# EAGLE design FLC100_shield_v2.0 (EAGLE 6.4)
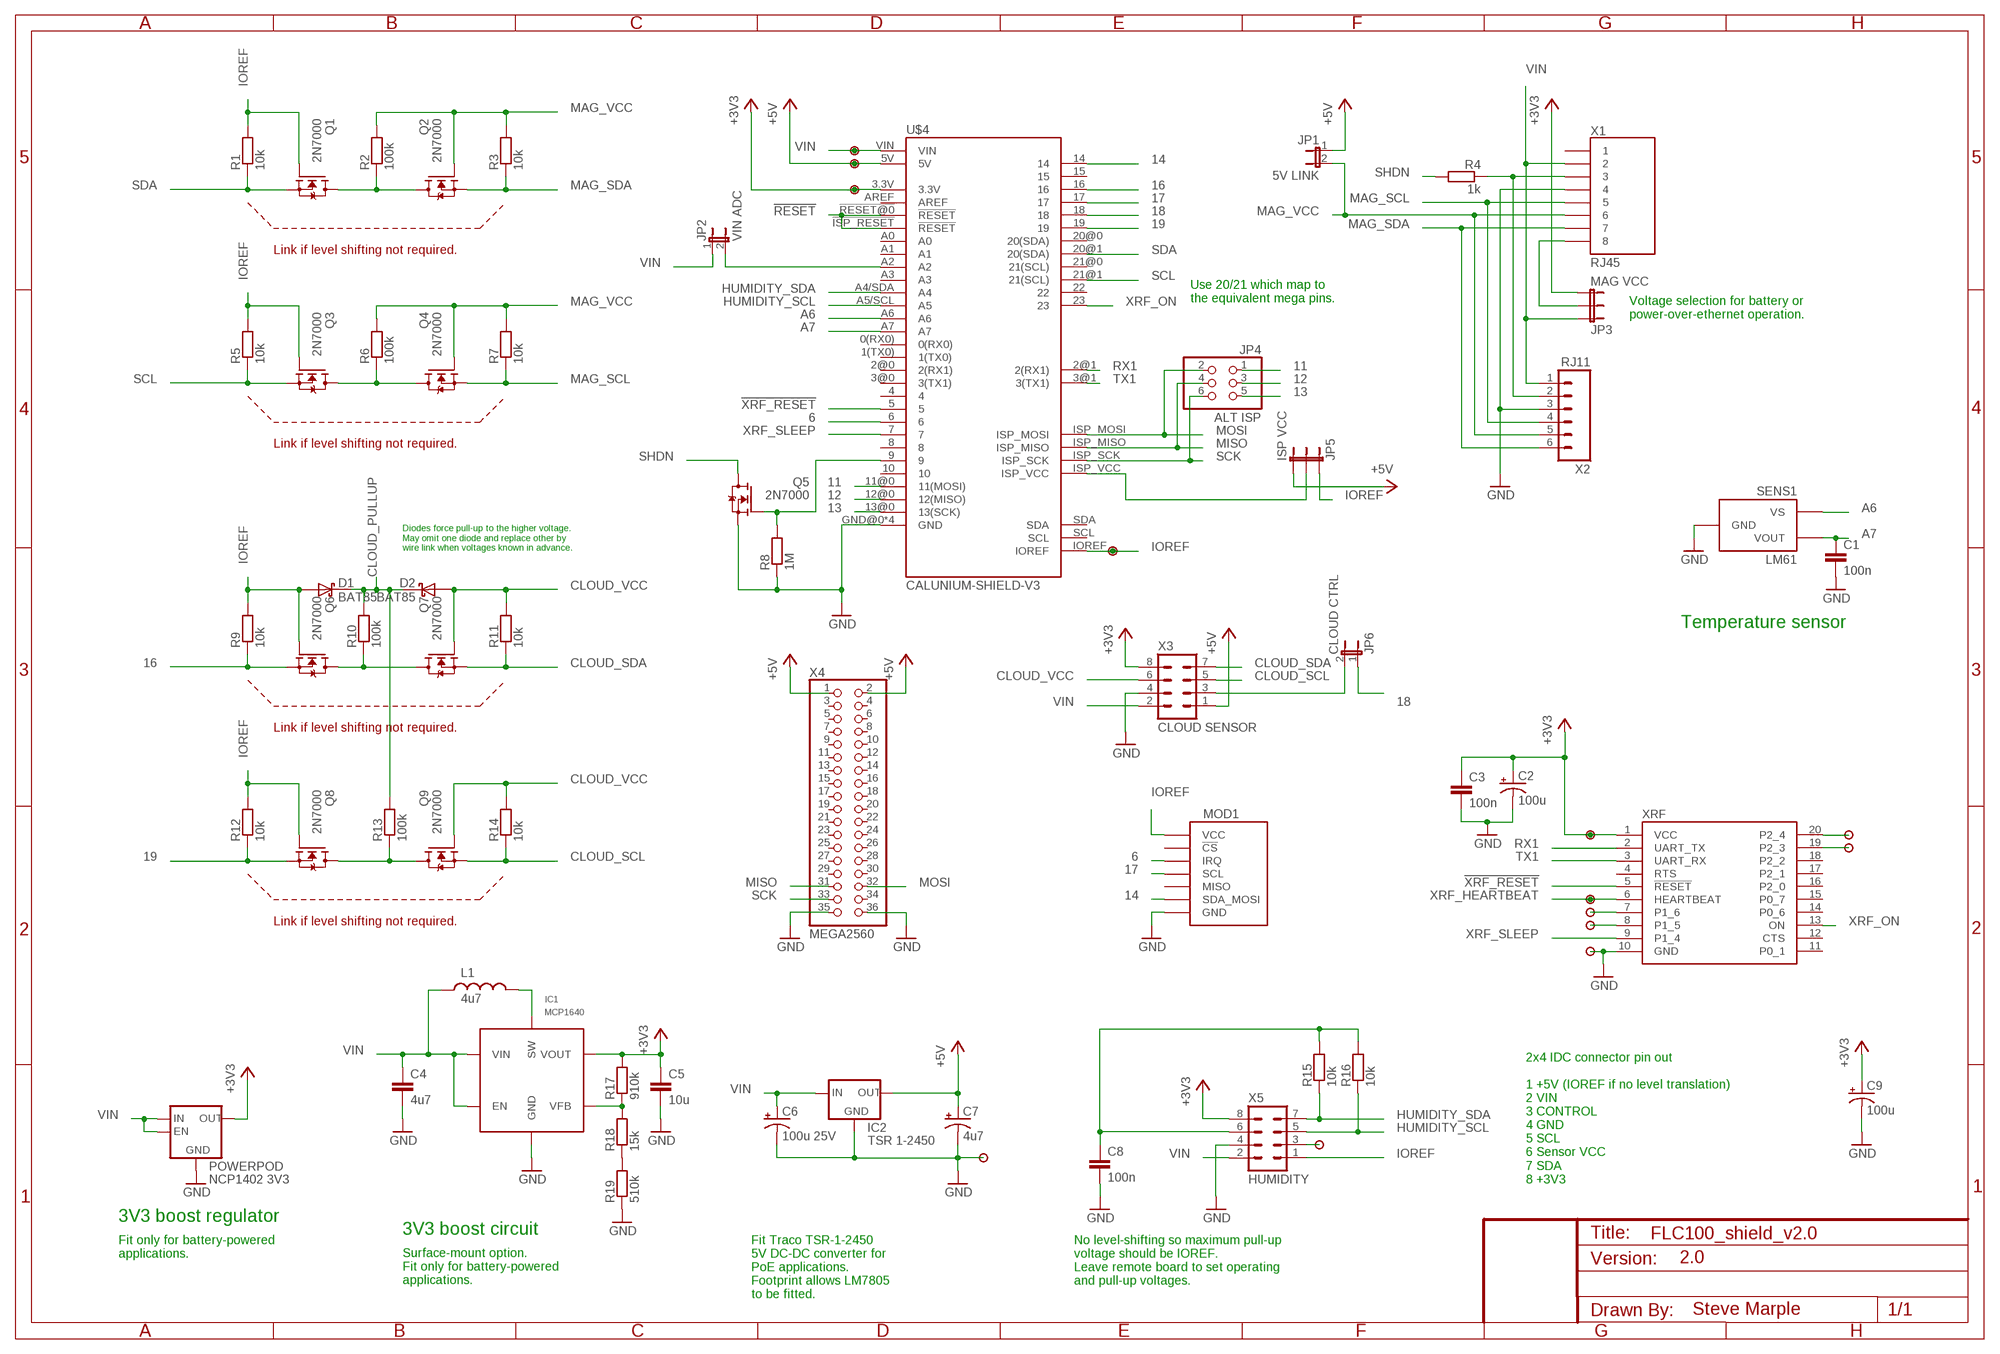
[diagram p0: schematic, sheet 1]

## Parts
C1  100n  CAPPTH  [CAP-PTH-SMALL]
C2  100u  CAP_POLPTH2  [CPOL-RADIAL-10UF-25V]
C3  100n  CAPPTH  [CAP-PTH-SMALL]
C4  4u7  C-EU1206-HAND  [1206-HAND]
C5  10u  C-EU1206-HAND  [1206-HAND]
C6  100u 25V  CAP_POL  [CPOL-RADIAL-100UF-25V-150MIL]
C7  4u7  CAP_POLPTH2  [CPOL-RADIAL-10UF-25V]
C8  100n  CAPPTH  [CAP-PTH-SMALL]
C9  100u  CAP_POLPTH2  [CPOL-RADIAL-10UF-25V]
D1  BAT85  DIODE-SCHOTTKY  [DIODE-TH-0.4]
D2  BAT85  DIODE-SCHOTTKY  [DIODE-TH-0.4]
IC1  MCP1640  MCP1640SOT23-6-HAND  [SOT23-6-HAND]
IC2  TSR 1-2450  V_REG_78XXSIDE  [78XXL]
JP1  5V LINK  JUMPER-2PTH  [1X02]
JP2  VIN ADC  JUMPER-2PTH  [1X02]
JP3  MAG VCC  JUMPER-3PTH  [1X03]
JP4  ALT ISP  PINHD-2X3  [2X03]
JP5  ISP VCC  JUMPER-3PTH  [1X03]
JP6  CLOUD CTRL  JUMPER-2PTH  [1X02]
L1  4u7  INDUCTORTH-2MM  [INDUCTOR-TH-2MM]
MOD1  EMBEDDED_ADVENTURES_MOD-1016NO-HOLES  [EMBEDDED_ADVENTURES_MOD-1016-NO-HOLES]
POWERPOD  NCP1402 3V3  CISECO_POWERPOD_NCP1402  [CISECO_POWERPOD_NCP1402]
Q1  2N7000  [TO-92]
Q2  2N7000  [TO-92]
Q3  2N7000  [TO-92]
Q4  2N7000  [TO-92]
Q5  2N7000  [TO-92]
Q6  2N7000  [TO-92]
Q7  2N7000  [TO-92]
Q8  2N7000  [TO-92]
Q9  2N7000  [TO-92]
R1  10k  RESISTOR  [RES-AXIAL-0.4]
R2  100k  RESISTOR  [RES-AXIAL-0.4]
R3  10k  RESISTOR  [RES-AXIAL-0.4]
R4  1k  RESISTOR  [RES-AXIAL-0.4]
R5  10k  RESISTOR  [RES-AXIAL-0.4]
R6  100k  RESISTOR  [RES-AXIAL-0.4]
R7  10k  RESISTOR  [RES-AXIAL-0.4]
R8  1M  RESISTOR  [RES-AXIAL-0.4]
R9  10k  RESISTOR  [RES-AXIAL-0.4]
R10  100k  RESISTOR  [RES-AXIAL-0.4]
R11  10k  RESISTOR  [RES-AXIAL-0.4]
R12  10k  RESISTOR  [RES-AXIAL-0.4]
R13  100k  RESISTOR  [RES-AXIAL-0.4]
R14  10k  RESISTOR  [RES-AXIAL-0.4]
R15  10k  RESISTOR  [RES-AXIAL-0.4]
R16  10k  RESISTOR  [RES-AXIAL-0.4]
R17  910k  RESISTOR1206-HAND  [1206-HAND]
R18  15k  RESISTOR1206-HAND  [1206-HAND]
R19  510k  RESISTOR1206-HAND  [1206-HAND]
SENS1  LM61  [TO-92]
U$1  PAD  [PAD]
U$2  PAD  [PAD]
U$3  PAD  [PAD]
U$4  CALUNIUM-SHIELD-V3  CALUNIUM-SHIELD-V3V3-NO-HOLES-NO-TEXT  [CALUNIUM-SHIELD-NO-OUTLINE-NO-HOLES-NO-TEXT-V3]
U$5  PAD  [PAD]
U$6  PAD  [PAD]
U$7  PAD  [PAD]
U$8  PAD  [PAD]
U$9  PAD  [PAD]
U$10  PAD  [PAD]
U$11  PAD  [PAD]
U$12  PAD  [PAD]
U$13  PAD  [PAD]
U$14  PAD  [PAD]
X1  RJ45  RJ45-8PTH  [RJ45-8]
X2  RJ11  RJ11-6PTH  [RJ11-6]
X3  CLOUD SENSOR  ML8  [ML8]
X4  MEGA2560  PINHD-2X18  [2X18]
X5  HUMIDITY  ML8  [ML8]
XRF  XRFB1  [XBEE]

## Nets
6: MOD1.IRQ U$4.6
11: JP4.1 U$4.11@0(11(MOSI))
12: JP4.3 U$4.12@0(12(MISO))
13: JP4.5 U$4.13@0(13(SCK))
14: MOD1.SDA_MOSI U$4.14
16: Q6.1(S) R9.P$1 U$4.16
17: MOD1.SCL U$4.17
18: JP6.1 U$4.18
19: Q8.1(S) R12.P$1 U$4.19
!RESET: U$4.!ISP_RESET(!RESET) U$4.!RESET@0(!RESET)
!XRF_RESET: U$4.5 XRF.5(!RESET)
+3V3 [power]: C2.1(+) C3.1 C5.1 C9.1(+) IC1.5(VOUT) JP3.3 POWERPOD.VOUT(OUT) R17.2 U$3.1 U$4.3.3V U$6.1 X3.8 X5.8 XRF.1(VCC)
+5V [power]: C7.1(+) IC2.OUT JP1.1 JP5.3 U$2.1 U$4.5V X3.1 X4.1 X4.2
A6: SENS1.1(VS) U$4.A6
A7: C1.1 SENS1.2(VOUT) U$4.A7
CLOUD_PULLUP: D1.C D2.C R10.P$2 R13.P$2
CLOUD_SCL: Q9.1(S) R14.P$1 X3.5
CLOUD_SDA: Q7.1(S) R11.P$1 X3.7
CLOUD_VCC: D2.A Q7.2(G) Q9.2(G) R11.P$2 R14.P$2 X3.6
GND [power]: C1.2 C2.2(-) C3.2 C4.2 C5.2 C6.2(-) C7.2(-) C8.2 C9.2(-) IC1.2(GND) IC2.GND MOD1.GND POWERPOD.GND Q5.1(S) R8.P$1 R19.1 SENS1.3(GND) U$4.GND@0(GND) U$4.GND@1(GND) U$4.GND@2(GND) U$4.GND@3(GND) U$12.1 U$14.1 X1.4 X2.3 X3.4 X4.35 X4.36 X5.4 XRF.10(GND)
HUMIDITY_SCL: R16.P$1 U$4.A5/SCL(A5) X5.5
HUMIDITY_SDA: R15.P$1 U$4.A4/SDA(A4) X5.7
IOREF [power]: D1.A JP5.1 MOD1.VCC Q1.2(G) Q3.2(G) Q6.2(G) Q8.2(G) R1.P$2 R5.P$2 R9.P$2 R12.P$2 U$4.IOREF U$5.1 X5.1
ISP_VCC [power]: JP5.2 U$4.ISP_VCC
MAG_SCL: Q4.1(S) R7.P$1 X1.5 X2.4
MAG_SDA: Q2.1(S) R3.P$1 X1.7 X2.6
MAG_VCC: JP1.2 Q2.2(G) Q4.2(G) R2.P$2 R3.P$2 R6.P$2 R7.P$2 X1.6 X2.5
MISO: JP4.4 U$4.ISP_MISO X4.31
MOSI: JP4.2 U$4.ISP_MOSI X4.32
N$1: Q1.3(D) Q2.3(D) R2.P$1
N$2: Q3.3(D) Q4.3(D) R6.P$1
N$3: JP6.2 X3.3
N$4: Q6.3(D) Q7.3(D) R10.P$1
N$5: Q8.3(D) Q9.3(D) R13.P$1
N$6: R4.P$1 X1.3 X2.2
N$7 [power]: JP3.2 X1.8
N$10 [power]: JP2.2 U$4.A2
N$16: U$13.1 X5.3
N$22: C8.1 R15.P$2 R16.P$2 X5.6
N$25: U$8.1 XRF.19(P2_3)
N$26: Q5.2(G) R8.P$2 U$4.9
N$27: U$7.1 XRF.20(P2_4)
N$41: IC1.1(SW) L1.P$2
N$42: R18.1 R19.2
N$46: IC1.4(VFB) R17.1 R18.2
RX1: U$4.2@1(2(RX1)) XRF.2(UART_TX)
SCK: JP4.6 U$4.ISP_SCK X4.33
SCL: Q3.1(S) R5.P$1 U$4.21@1(21(SCL))
SDA: Q1.1(S) R1.P$1 U$4.20@1(20(SDA))
SHDN: Q5.3(D) R4.P$2
TX1: U$4.3@1(3(TX1)) XRF.3(UART_RX)
VIN [power]: C4.1 C6.1(+) IC1.3(EN) IC1.6(VIN) IC2.IN JP2.1 JP3.1 L1.P$1 POWERPOD.ENABLE POWERPOD.VIN(IN) U$1.1 U$4.VIN X1.2 X2.1 X3.2 X5.2
XRF_HEARTBEAT: U$9.1 XRF.6(HEARTBEAT)
XRF_ON: U$4.23 XRF.13(ON)
XRF_P1_5: U$11.1 XRF.8(P1_5)
XRF_P1_6: U$10.1 XRF.7(P1_6)
XRF_SLEEP: U$4.7 XRF.9(P1_4)
Unconnected: MOD1.!CS MOD1.MISO U$4.0(RX0) U$4.1(TX0) U$4.2@0(2(RX1)) U$4.3@0(3(TX1)) U$4.4 U$4.8 U$4.10 U$4.15 U$4.20@0(20(SDA)) U$4.21@0(21(SCL)) U$4.22 U$4.A0 U$4.A1 U$4.A3 U$4.AREF U$4.SCL U$4.SDA X1.1 X4.3 X4.4 X4.5 X4.6 X4.7 X4.8 X4.9 X4.10 X4.11 X4.12 X4.13 X4.14 X4.15 X4.16 X4.17 X4.18 X4.19 X4.20 X4.21 X4.22 X4.23 X4.24 X4.25 X4.26 X4.27 X4.28 X4.29 X4.30 X4.34 XRF.4(RTS) XRF.11(P0_1) XRF.12(CTS) XRF.14(P0_6) XRF.15(P0_7) XRF.16(P2_0) XRF.17(P2_1) XRF.18(P2_2)

## Notes on the sheet
- Link if level shifting not required.
- Use 20/21 which map to
  the equivalent mega pins.
- Voltage selection for battery or
  power-over-ethernet operation.
- Link if level shifting not required.
- Diodes force pull-up to the higher voltage.
  May omit one diode and replace other by
  wire link when voltages known in advance.
- Temperature sensor
- Link if level shifting not required.
- Link if level shifting not required.
- 2x4 IDC connector pin out
  
  1 +5V (IOREF if no level translation)
  2 VIN
  3 CONTROL
  4 GND
  5 SCL
  6 Sensor VCC
  7 SDA
  8 +3V3
- 3V3 boost regulator
- Fit only for battery-powered
  applications.
- 3V3 boost circuit
- Fit Traco TSR-1-2450
  5V DC-DC converter for
  PoE applications.
  Footprint allows LM7805
  to be fitted.
- No level-shifting so maximum pull-up
  voltage should be IOREF.
  Leave remote board to set operating
  and pull-up voltages.
- Surface-mount option.
  Fit only for battery-powered
  applications.
- 2.0
- Steve Marple

## Library data of the parts
C1 C3 C8 = SparkFun:CAP: Capacitor Standard 0603 ceramic capacitor, and 0.1" leaded capacitor.
C2 C6 C7 C9 = SteveMarple:CAP_POL: Capacitor Polarized These are standard SMD and PTH capacitors. Normally 10uF, 47uF, and 100uF in electrolytic and tantalum varieties. Always verify the external diameter of the through hole cap, it varies with capacity, voltage, and manufacturer. The EIA devices should be standard.
C4 C5 = SteveMarple:C-EU
D1 D2 = SteveMarple:DIODE-SCHOTTKY
IC1 = SteveMarple:MCP1640: MCP1640 0.65V Start-up Synchronous Boost Regulator with True Output Disconnect or Input/Output Bypass Option
IC2 = SteveMarple:V_REG_78XX: Voltage Regulator Standard 7805 5V regulator. IGO (Input Ground Output). Spark Fun Electronics SKU : COM-00107
JP1 JP2 JP6 = SparkFun:JUMPER-2: Jumper Basic 0.1" spaced jumper. Use with breakaway headers.
JP3 JP5 = SparkFun:JUMPER-3
JP4 = pinhead:PINHD-2X3: PIN HEADER
L1 = SteveMarple:INDUCTOR: Inductors Basic Inductor/Choke - 0603 and 1206. Footprints are not proven and vary greatly between part numbers.
MOD1 = SteveMarple:EMBEDDED_ADVENTURES_MOD-1016
POWERPOD = SteveMarple:CISECO_POWERPOD_NCP1402
Q1-Q9 = SteveMarple:2N7000: 2N7000 FET
R1-R19 = SteveMarple:RESISTOR: 1/4W PTH resistor
SENS1 = SteveMarple:LM61
U$1-U$3 U$5-U$14 = SteveMarple:PAD
U$4 = SteveMarple:CALUNIUM-SHIELD-V3
X1 = SteveMarple:RJ45-8: RJ45 Jack Simple RJ45, 8-pin connection - connector for common Cat5, Cat5e, and Cat6 Ethernet cables. Footprint not yet proven in production. Connector sku is PRT-00643; Breakout PCB sku is BOB-00716.
X2 = SteveMarple:RJ11-6: RJ11 Jack Simple 6 pin RJ11 jack. Commonly found on CAT3 devices and Microchip programmers. SKU: PRT-00132
X3 X5 = SteveMarple:ML8
X4 = pinhead:PINHD-2X18: PIN HEADER
XRF = SteveMarple:XRF

## Net classes
1 power: width 0.381 mm
2 antenna: width 0.381 mm

## Board
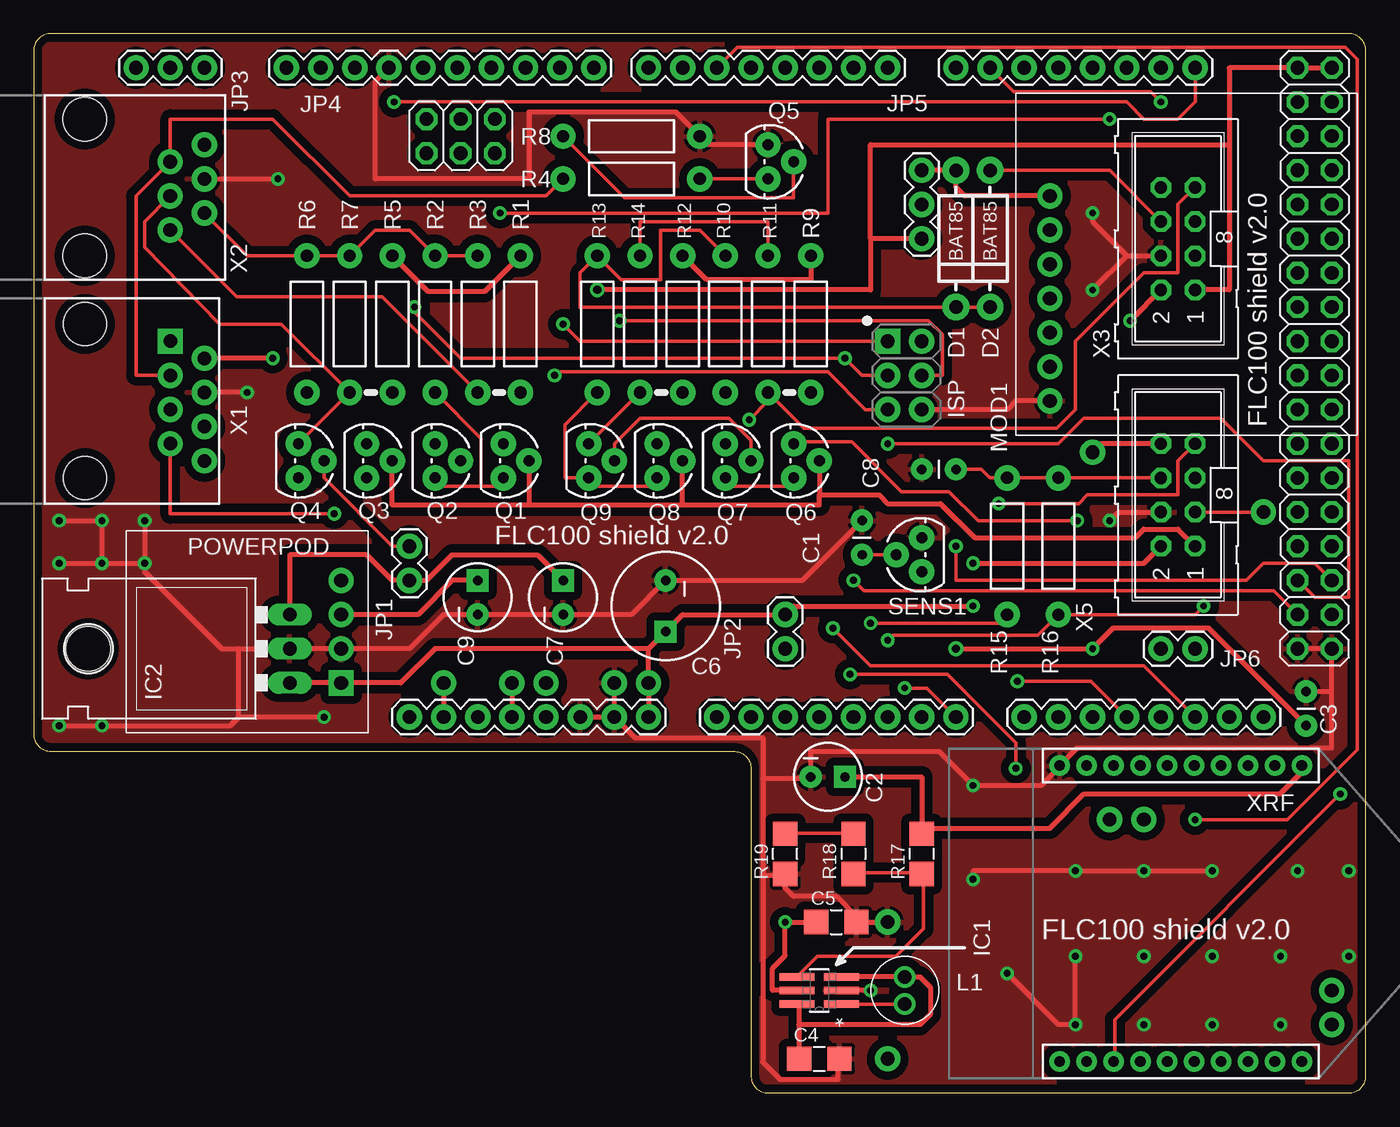
[diagram p1: board, top side]
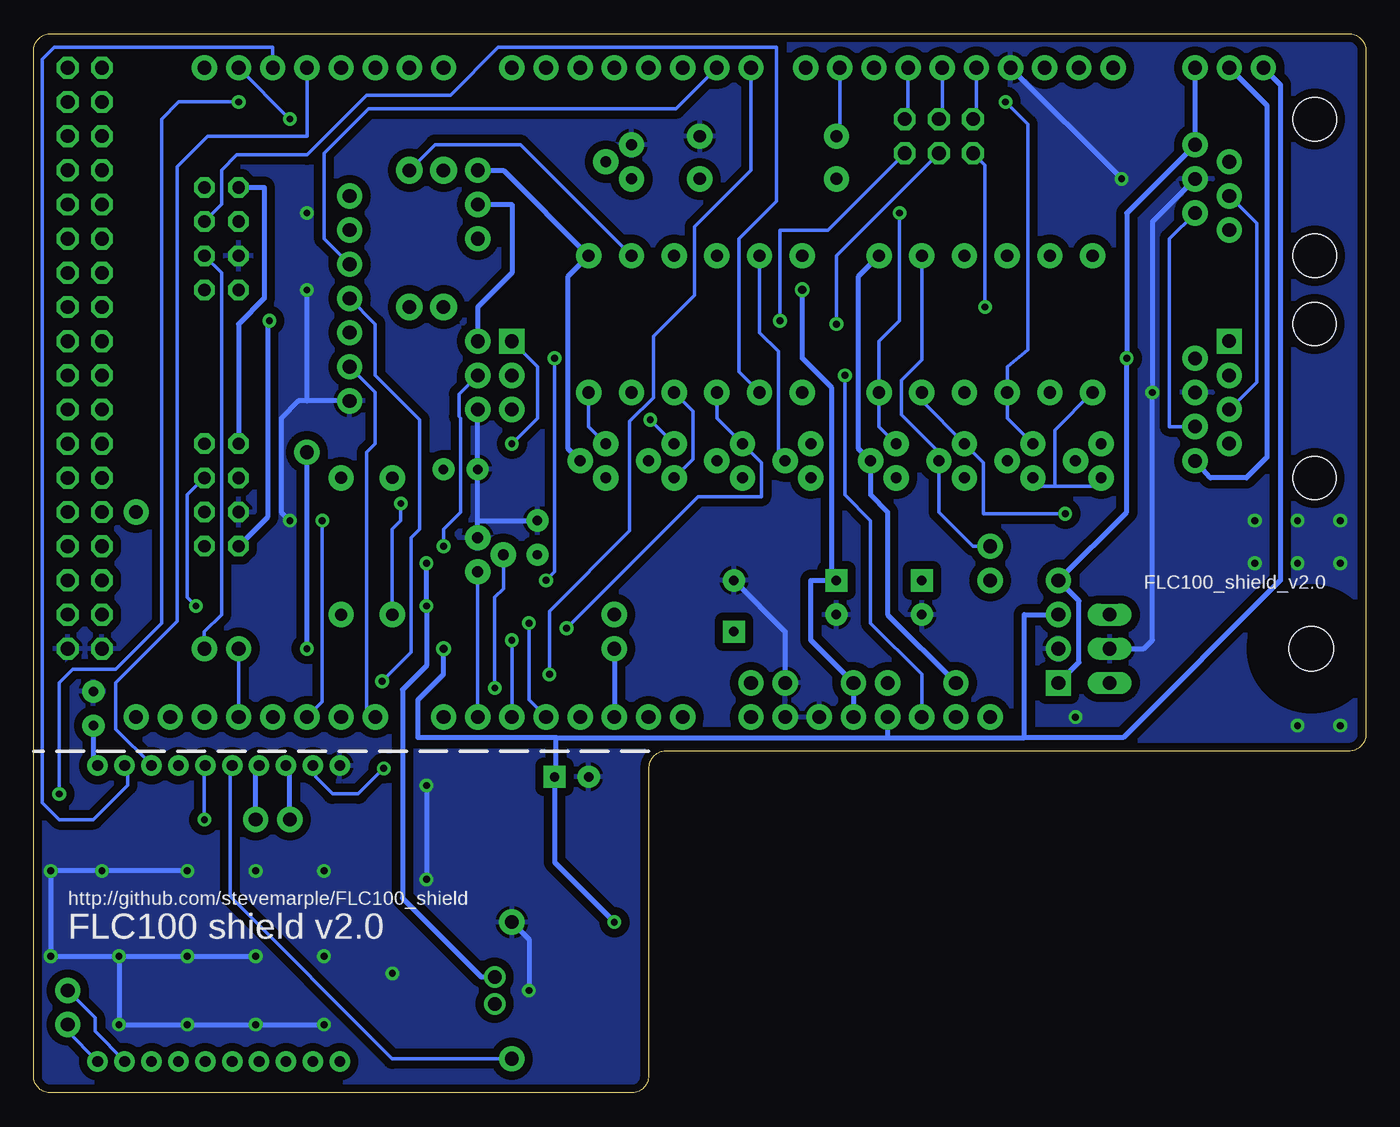
[diagram p2: board, bottom side, seen from below]

Size 99.06 x 78.74 mm. Coordinates in mm from the lower left corner, seen from the top.
Outline: 54.61,0 97.79,0 arc90 99.06,1.27 99.06,77.47 arc90 97.79,78.74 1.27,78.74 arc90 0,77.47 0,26.67 arc90 1.27,25.4 52.07,25.4 arc-90 53.34,24.13 53.34,1.27 arc90 54.61,0
Copper layers (1*16): Top 0.035mm / dielectric 1.5mm / Bottom 0.035mm
Design rules "SparkFun_Iteadstudio_10_12mil": minimum track width 10mil, minimum drill 20mil, track to track 12mil, track to pad 12mil, pad to pad 12mil, via to via 12mil, smd to smd 12mil, copper to edge 0.5mm, drill to drill 8mil, minimum pad ring 12mil, minimum via ring 10mil, stop-mask expansion 4mil, vias tented up to drill 25mil, thermal gap 10mil

### Footprints (pad centres in the part's own frame; a part is rotated, then mirrored left to right if it is on the bottom)
CAP-PTH-SMALL = drill 0.7 pad 1.651: 1 0,0; 2 2.54,0
CPOL-RADIAL-10UF-25V = drill 0.7 pad 1.651 square: 1 1.27,0 | drill 0.7 pad 1.651: 2 -1.27,0
1206-HAND = smd 1.8 x 1.803: 1 -1.499,0; 2 1.499,0
CPOL-RADIAL-100UF-25V-150MIL = drill 0.7 pad 1.651 square: 1 1.905,0 | drill 0.7 pad 1.651: 2 -1.905,0
DIODE-TH-0.4 = drill 1 pad 1.981: A -5.08,0; C 5.08,0
SOT23-6-HAND = smd 2.591 x 0.559: 1 -1.651,1.016; 2 -1.651,0; 3 -1.651,-1.016; 4 1.651,-1.016; 5 1.651,0; 6 1.651,1.016
78XXL = drill 1.016 long: GND 0,-3.81; IN -2.54,-3.81; OUT 2.54,-3.81 | hole 3.302: 0,11.176
1X02 = drill 1.016 pad 1.88: 1 0,0; 2 2.54,0
1X03 = drill 1.016 pad 1.88: 1 0,0; 2 2.54,0; 3 5.08,0
2X03 = drill 1.016 octagon: 1 -2.54,-1.27; 2 -2.54,1.27; 3 0,-1.27; 4 0,1.27; 5 2.54,-1.27; 6 2.54,1.27
INDUCTOR-TH-2MM = drill 1: P$1 -1,0; P$2 1,0
EMBEDDED_ADVENTURES_MOD-1016-NO-HOLES = drill 1.016 pad 1.88: !CS -2.54,-10.16; GND 10.16,-10.16; IRQ 0,-10.16; MISO 5.08,-10.16; SCL 2.54,-10.16; SDA_MOSI 7.62,-10.16; VCC -5.08,-10.16
CISECO_POWERPOD_NCP1402 = drill 1.016 pad 1.88: ENABLE 3.81,-6.985; GND -1.27,-6.985; VOUT 1.27,-6.985 | drill 1.016 pad 1.88 square: VIN -3.81,-6.985
TO-92 = drill 0.813 pad 1.88: 1 -1.27,0; 2 0,1.905; 3 1.27,0
RES-AXIAL-0.4 = drill 0.9 pad 1.88: P$1 -5.08,0; P$2 5.08,0
PAD = drill 1.016 pad 1.88: 1 0,0
CALUNIUM-SHIELD-NO-OUTLINE-NO-HOLES-NO-TEXT-V3 = drill 1.016 pad 1.88: 0(RX0) 0,21.59; 1(TX0) -2.54,21.59; 2@0 -5.08,21.59; 2@1 17.78,21.59; 3.3V -27.94,-26.67; 3@0 -7.62,21.59; 3@1 15.24,21.59; 4 -10.16,21.59; 5 -12.7,21.59; 5V -25.4,-26.67; 6 -15.24,21.59; 7 -17.78,21.59; 8 -21.844,21.59; 9 -24.384,21.59; 10 -26.924,21.59; 11@0 -29.464,21.59; 12@0 -32.004,21.59; 13@0 -34.544,21.59; 14 10.16,-26.67; 15 12.7,-26.67; 16 15.24,-26.67; 17 17.78,-26.67; 18 20.32,-26.67; 19 22.86,-26.67; 20@0 25.4,-26.67; 20@1 20.32,21.59; 21@0 27.94,-26.67; 21@1 22.86,21.59; 22 5.08,21.59; 23 7.62,21.59; !ISP_RESET 0,-3.81; !RESET@0 -30.48,-26.67; A0 -12.7,-26.67; A1 -10.16,-26.67; A2 -7.62,-26.67; A3 -5.08,-26.67; A4/SDA -2.54,-26.67; A5/SCL 0,-26.67; A6 2.54,-26.67; A7 5.08,-26.67; AREF -39.624,21.59; GND@0 -22.86,-26.67; GND@1 -20.32,-26.67; GND@2 -37.084,21.59; GND@3 2.54,-3.81; IOREF -33.02,-26.67; ISP_MOSI 2.54,-1.27; ISP_SCK 0,-1.27; ISP_VCC 2.54,1.27; NC -35.56,-26.67; NC@0 12.7,21.59; NC@1 10.16,21.59; SCL -44.704,21.59; SDA -42.164,21.59; VIN -17.78,-26.67 | drill 1.016 pad 1.88 square: ISP_MISO 0,1.27
RJ45-8 = drill 1 pad 1.88 square: 1 -4.445,6.35 | drill 1 pad 1.88: 2 -3.175,8.89; 3 -1.905,6.35; 4 -0.635,8.89; 5 0.635,6.35; 6 1.905,8.89; 7 3.175,6.35; 8 4.445,8.89 | hole 3.2: -5.715,0; 5.715,0
RJ11-6 = drill 1.016 pad 1.88: 1 1.905,8.89; 2 3.175,6.35; 3 4.445,8.89; 4 5.715,6.35; 5 6.985,8.89; 6 8.255,6.35 | hole 3.251: 0,0; 10.16,0
ML8 = drill 0.914 octagon: 1 -3.81,-1.27; 2 -3.81,1.27; 3 -1.27,-1.27; 4 -1.27,1.27; 5 1.27,-1.27; 6 1.27,1.27; 7 3.81,-1.27; 8 3.81,1.27
2X18 = drill 1.016 octagon: 1 -21.59,-1.27; 2 -21.59,1.27; 3 -19.05,-1.27; 4 -19.05,1.27; 5 -16.51,-1.27; 6 -16.51,1.27; 7 -13.97,-1.27; 8 -13.97,1.27; 9 -11.43,-1.27; 10 -11.43,1.27; 11 -8.89,-1.27; 12 -8.89,1.27; 13 -6.35,-1.27; 14 -6.35,1.27; 15 -3.81,-1.27; 16 -3.81,1.27; 17 -1.27,-1.27; 18 -1.27,1.27; 19 1.27,-1.27; 20 1.27,1.27; 21 3.81,-1.27; 22 3.81,1.27; 23 6.35,-1.27; 24 6.35,1.27; 25 8.89,-1.27; 26 8.89,1.27; 27 11.43,-1.27; 28 11.43,1.27; 29 13.97,-1.27; 30 13.97,1.27; 31 16.51,-1.27; 32 16.51,1.27; 33 19.05,-1.27; 34 19.05,1.27; 35 21.59,-1.27; 36 21.59,1.27
XBEE = drill 0.8 pad 1.524: 1 -11,20; 2 -11,18; 3 -11,16; 4 -11,14; 5 -11,12; 6 -11,10; 7 -11,8; 8 -11,6; 9 -11,4; 10 -11,2; 11 11,2; 12 11,4; 13 11,6; 14 11,8; 15 11,10; 16 11,12; 17 11,14; 18 11,16; 19 11,18; 20 11,20

### Placement (x,y rotation side)
C1  61.59,40.01 90 top
C2  59.05,23.5 0 top
C3  94.61,27.3 90 top
C4  58.42,2.54 0 top
C5  59.69,12.7 0 top
C6  46.99,36.2 270 top
C7  39.37,36.83 90 top
C8  68.58,46.35 180 top
C9  33.02,36.83 90 top
D1  68.58,63.5 270 top
D2  71.12,63.5 270 top
IC1  58.42,7.62 180 top
IC2  15.24,33.02 90 top
JP1  27.94,38.1 90 top
JP2  55.88,35.56 270 top
JP3  12.7,76.2 180 top
JP4  31.75,71.12 180 top
JP5  66.04,68.58 270 top
JP6  83.82,33.02 0 top
L1  64.77,7.62 270 top
MOD1  85.72,61.59 270 top
POWERPOD  15.88,34.29 90 top
Q1  34.92,46.99 270 top
Q2  29.84,46.99 270 top
Q3  24.77,46.99 270 top
Q4  19.68,46.99 270 top
Q5  54.61,69.22 270 top
Q6  56.52,46.99 270 top
Q7  51.44,46.99 270 top
Q8  46.35,46.99 270 top
Q9  41.27,46.99 270 top
R1  36.2,57.15 90 top
R2  29.84,57.15 90 top
R3  33.02,57.15 90 top
R4  44.45,67.94 0 top
R5  26.67,57.15 90 top
R6  20.32,57.15 90 top
R7  23.5,57.15 90 top
R8  44.45,71.12 180 top
R9  57.78,57.15 90 top
R10  51.44,57.15 90 top
R11  54.61,57.15 90 top
R12  48.26,57.15 90 top
R13  41.91,57.15 90 top
R14  45.09,57.15 90 top
R15  72.39,40.64 90 top
R16  76.2,40.64 90 top
R17  66.04,17.78 90 top
R18  60.96,17.78 270 top
R19  55.88,17.78 90 top
SENS1  66.04,40.01 90 top
U$1  45.72,30.48 0 top
U$2  38.1,30.48 0 top
U$3  35.56,30.48 0 top
U$4  63.5,54.61 0 top
U$5  30.48,30.48 0 top
U$6  78.74,47.62 0 top
U$7  96.52,5.08 0 top
U$8  96.52,7.62 0 top
U$9  63.5,2.54 270 top
U$10  82.55,20.32 270 top
U$11  80.01,20.32 0 top
U$12  63.5,12.7 0 top
U$13  91.44,43.18 0 top
U$14  43.18,30.48 0 top
X1  3.81,51.44 270 top
X2  3.81,72.39 270 top
X3  85.09,63.5 90 top
X4  95.25,54.61 270 top
X5  85.09,44.45 90 top
XRF  74.3,13.34 270 top

### Tracks (layer width: path | path; a pad name or v marks a point on that pad's centre or on a via)
6
  Bottom 0.254: U$4.6 51.31,73.15 74.17,73.15 77.47,69.85 77.47,63.5 MOD1.IRQ
11
  Bottom 0.254: JP4.1 34.04,72.64 U$4.11@0
12
  Bottom 0.254: JP4.3 31.5,72.64 U$4.12@0
13
  Bottom 0.254: JP4.5 28.96,72.64 U$4.13@0
14
  Bottom 0.254: U$4.14 74.3,28.57 74.3,47.62 73.66,48.26 73.66,52.07 MOD1.SDA_MOSI
16  (via drill 0.51)
  Top 0.254: v77.6,42.55 70.23,42.55 68.07,44.7 64.52,44.7 60.83,48.39 56.64,48.39 Q6.1
  Bottom 0.254: Q6.1 57.78,49.53 R9.P$1 | U$4.16 77.6,29.08 v77.6,42.55
17  (via drill 0.51)
  Top 0.254: U$4.17 78.61,30.61 v73.15,30.61
  Bottom 0.254: v73.15,30.61 70.99,32.77 70.99,41.27 70.36,41.91 70.36,50.04 73.66,53.34 73.66,57.15 MOD1.SCL
18
  Bottom 0.254: JP6.1 U$4.18
19  (via drill 0.51)
  Top 0.254: U$4.19 82.55,31.75 62.23,31.75 v59.44,34.54
  Bottom 0.254: R12.P$1 48.26,50.16 Q8.1 44.96,46.86 44.96,44.32 49.66,44.32 v59.44,34.54
!RESET  (via drill 0.51)
  Top 0.254: v38.73,53.34 38.99,53.59 59.05,53.59 61.85,50.8 U$4.!ISP_RESET
  Bottom 0.254: U$4.!RESET@0 33.02,31.11 36.83,34.92 36.83,42.55 38.73,44.45 v38.73,53.34
!XRF_RESET  (via drill 0.51)
  Top 0.254: v86.36,20.32 93.22,20.32 98.42,25.53 98.42,76.83 97.54,77.72 52.32,77.72 U$4.5
  Bottom 0.254: v86.36,20.32 86.36,24.26 XRF.5
+3V3  (via drill 0.51, 0.6)
  Top 0.381: U$3.1 U$4.3.3V | X5.8 79.38,48.26 U$6.1 | IC1.5 54.94,7.62 54.94,9.27 55.88,10.21 v55.88,12.7 C5.1 | 66.04,19.68 66.04,23.5 C2.1 | 66.04,19.68 75.56,19.68 78.11,22.23 92.71,22.23 94.23,23.75 94.23,24.26 XRF.1 | R17.2 66.04,19.68 | C3.1 87.38,34.54 80.26,34.54 v78.74,33.02 v68.58,33.02 | C9.1 31.11,38.1 28.57,35.56 POWERPOD.VOUT
  Bottom 0.381: POWERPOD.VOUT 25.4,35.56 25.4,26.42 | 35.56,26.42 25.4,26.42 | U$4.3.3V 35.56,26.42 | X5.8 83.82,57.15 81.92,59.05 81.92,67.31 X3.8 | C3.1 94.61,24.64 94.36,24.38 XRF.1 | v55.88,12.7 60.33,17.14 C2.1 60.2,23.62 60.2,26.42 | v78.74,33.02 U$6.1 | 60.2,26.42 35.56,26.42 | 60.2,26.42 70.48,26.42 70.48,29.21 68.58,31.11 v68.58,33.02 | JP3.3 6.35,74.93 6.35,38.1 18.03,26.42 25.4,26.42
+5V  (via drill 0.6)
  Top 0.381: IC2.OUT 19.05,40.01 24.77,40.01 26.67,38.1 JP1.1 29.21,38.1 31.11,40.01 37.47,40.01 C7.1 | X3.1 88.9,59.69 88.9,70.48 | 88.9,70.48 62.23,70.48 62.23,63.5 | v41.91,59.69 62.23,59.69 62.23,63.5 | JP5.3 62.23,63.5 | 88.9,70.48 88.9,76.2 X4.1 X4.2
  Bottom 0.381: 39.75,38.1 41.27,38.1 41.27,33.66 U$2.1 U$4.5V | 39.75,38.1 39.75,52.45 41.91,54.61 v41.91,59.69 | 39.75,38.1 C7.1
A6
  Bottom 0.254: SENS1.1 U$4.A6
A7  (via drill 0.51)
  Top 0.254: SENS1.2 C1.1 | U$4.A7 66.42,30.1 v64.77,30.1
  Bottom 0.254: SENS1.2 64.14,37.47 64.77,36.83 v64.77,30.1
CLOUD_PULLUP
  Top 0.254: R10.P$2 49.53,64.14 46.61,64.14 46.61,60.45 43.69,60.45 R13.P$2 40.64,60.96 40.64,58.42 D1.C D2.C
CLOUD_SCL
  Top 0.254: R14.P$1 Q9.1
  Bottom 0.254: X3.5 85.09,66.04 85.09,68.58 83.95,69.72 78.74,69.72 74.3,74.17 68.07,74.17 64.52,77.72 43.81,77.72 43.81,66.29 46.61,63.5 46.61,53.59 R14.P$1
CLOUD_SDA  (via drill 0.51)
  Top 0.254: X3.7 85.09,66.04 85.09,60.96 82.55,60.96 77.47,55.88 77.47,50.8 76.07,49.4 57.28,49.4 R11.P$1 54.61,51.44 v53.21,50.04
  Bottom 0.254: v53.21,50.04 Q7.1
CLOUD_VCC
  Top 0.254: Q9.2 43.18,48.26 45.09,50.16 51.69,50.16 53.34,48.51 Q7.2 | X3.6 80.01,68.58 D2.A | R14.P$2 45.09,64.77 54.61,64.77 R11.P$2
  Bottom 0.254: D2.A 69.22,70.48 62.87,70.48 R11.P$2 | Q9.2 43.69,47.5 43.69,55.12 45.09,56.52 R14.P$2
GND  (via drill 0.51)
  Top 0.381: v62.23,7.62 IC1.2 | 54.23,16.13 54.23,2.29 55.5,1.02 59.82,1.02 59.82,2.54 C4.2 | 54.23,16.13 55.75,16.13 R19.1 55.88,15.24 56.52,14.61 59.69,14.61 60.96,13.34 C5.2 U$12.1 | X4.35 X4.36 96.52,29.84 | 76.33,24.38 XRF.10 | XRF.10 76.2,24.13 74.93,22.86 v69.85,22.86 67.31,25.4 57.78,25.4 C2.2 57.66,23.37 54.23,23.37 | 96.52,29.84 96.52,25.65 77.6,25.65 76.45,24.51 XRF.10 | 54.23,23.37 54.23,16.13 | v80.01,42.55 80.64,43.18 X5.4 | 81.28,62.23 X3.4 | v78.74,59.69 81.28,62.23 | U$4.GND@3 72.39,50.8 73.03,51.44 MOD1.GND | Q5.1 50.16,70.48 R8.P$1 47.75,72.9 36.83,72.9 36.83,67.94 25.4,67.94 25.4,75.18 U$4.GND@2 | v15.88,52.07 X1.4 | U$4.GND@1 U$4.GND@0 | U$4.GND@1 U$14.1 | X2.3 v18.16,67.94 | C1.2 57.15,38.1 C6.2 44.45,35.56 C7.2 C9.2 30.48,35.56 27.94,33.02 POWERPOD.GND IC2.GND 15.24,33.02 | 54.23,23.37 54.23,26.42 44.7,26.42 U$4.GND@1 | C3.2 96.52,29.84 | v69.85,15.88 69.85,16.51 v77.47,16.51 v82.55,16.51 v87.63,16.51 | v72.39,8.89 76.2,5.08 v77.47,5.08 v77.47,10.16 | v1.91,27.3 v5.08,27.3 14.61,27.3 15.24,27.94 | v5.08,39.37 v8.26,39.37 | v8.26,39.37 8.26,38.73 13.97,33.02 15.24,33.02 | v1.91,39.37 v5.08,39.37 | v1.91,42.55 v5.08,42.55 v5.08,39.37 | v8.26,42.55 v8.26,39.37 | v21.59,27.94 15.24,27.94 | 15.24,27.94 15.24,33.02 | v78.74,65.41 78.74,64.77 81.28,62.23
  Bottom 0.381: v62.23,7.62 62.23,11.43 U$12.1 | 66.04,42.55 C1.2 | SENS1.3 66.04,42.55 | 66.04,42.55 C8.2 U$4.GND@3 | v80.01,42.55 80.64,43.18 80.64,50.16 79.38,51.44 78.74,51.44 | MOD1.GND 78.74,51.44 | 78.74,51.44 v78.74,59.69 | X2.3 15.88,64.77 v15.88,52.07 15.88,33.66 16.51,33.02 IC2.GND | U$14.1 43.18,34.29 C6.2 | v18.16,67.94 U$4.GND@2 | v69.85,22.86 v69.85,15.88 | v87.63,16.51 v93.98,16.51 v97.79,16.51 v97.79,10.16 v92.71,10.16 | v92.71,10.16 v87.63,10.16 v82.55,10.16 | v92.71,10.16 v92.71,5.08 v87.63,5.08 v82.55,5.08 v77.47,5.08
  pour Bottom (isolate 0.61): 52.07,-1.27 52.07,24.13 -1.27,24.13 -1.27,80.01 100.33,80.01 100.33,-1.27
  pour Top (isolate 0.61): 50.8,-2.54 50.8,22.86 -2.54,22.86 -2.54,81.28 101.6,81.28 101.6,-2.54
HUMIDITY_SCL  (via drill 0.51)
  Top 0.254: v87,36.2 86.36,35.56 R16.P$1 74.68,34.04 63.88,34.04 v63.5,33.66
  Bottom 0.254: X5.5 87.63,44.45 87.63,36.83 v87,36.2 | v63.5,33.66 U$4.A5/SCL
HUMIDITY_SDA  (via drill 0.51)
  Top 0.254: X5.7 85.09,46.99 85.09,44.45 78.36,44.45 77.72,43.81 v71.75,43.81 | v62.23,34.92 71.75,34.92 R15.P$1
  Bottom 0.254: R15.P$1 72.39,41.91 71.75,42.55 v71.75,43.81 | U$4.A4/SDA 62.23,29.21 v62.23,34.92
IOREF
  Top 0.381: R5.P$2 29.34,59.56 33.53,59.56 R1.P$2 | U$5.1 U$4.IOREF | Q3.2 26.67,43.69 36.83,43.69 | Q1.2 36.83,43.69 | R12.P$2 50.04,60.45 57.78,60.45 R9.P$2 | MOD1.VCC 69.22,66.67 68.58,67.31 D1.A JP5.1 | X5.1 85.09,41.91 82.55,41.91 81.92,41.27 69.98,41.27 67.44,43.81 63.5,43.81 62.87,44.45 58.42,44.45 | Q6.2 58.42,44.45 | 48.26,43.69 Q8.2 | 48.26,43.69 58.42,43.69 58.42,44.45 | 48.26,43.69 36.83,43.69
  Bottom 0.381: U$5.1 35.56,35.56 35.56,43.18 36.83,44.45 Q1.2 37.72,47.88 37.72,60.71 R1.P$2 | JP5.1 64.14,68.58 R9.P$2 59.31,60.71 59.31,47.88 Q6.2
ISP_VCC
  Bottom 0.381: U$4.ISP_VCC 66.04,58.42 63.5,60.96 63.5,66.04 JP5.2
MAG_SCL
  Top 0.254: Q4.1 R7.P$1 18.41,57.15 13.84,57.15 8.26,62.87 8.26,64.77 X2.4
  Bottom 0.254: X1.5 8.13,52.83 8.13,64.64 X2.4
MAG_SDA  (via drill 0.51)
  Top 0.254: X1.7 10.16,43.05 v22.35,43.05 | X2.6 15.11,59.18 25.91,59.18 R3.P$1
  Bottom 0.254: v22.35,43.05 28.45,43.05 28.45,46.86 Q2.1 33.02,51.44 R3.P$1
MAG_VCC
  Top 0.254: Q4.2 21.59,45.72 26.67,40.64 JP1.2 | R3.P$2 R2.P$2 27.94,64.14 25.4,64.14 R7.P$2 R6.P$2 15.88,62.23 X2.5
  Bottom 0.254: JP1.2 29.21,40.64 31.75,43.18 Q2.2 31.75,47.62 34.54,50.42 34.54,52.96 33.02,54.48 R3.P$2 | X1.6 14.61,49.53 14.61,63.5 X2.5
MISO  (via drill 0.51)
  Top 0.254: v39.37,57.15 40.64,55.88 U$4.ISP_MISO | X4.31 95.25,36.83 97.79,36.83 97.79,46.99 91.44,46.99 88.27,50.16 78.11,50.16 76.2,48.26 v63.5,48.26
  Bottom 0.254: v39.37,57.15 39.37,62.23 JP4.4 | v63.5,48.26 61.59,50.16 61.59,53.98 U$4.ISP_MISO
MOSI  (via drill 0.51)
  Top 0.254: v43.56,57.4 66.55,57.4 67.56,56.39 67.56,53.34 U$4.ISP_MOSI | X4.32 95.25,39.37 91.44,39.37 90.17,38.1 68.58,38.1 v68.58,40.64
  Bottom 0.254: JP4.2 40.01,64.14 43.56,64.14 v43.56,57.4 | v68.58,40.64 68.58,41.91 67.31,43.18 67.31,50.16 67.44,50.29 67.44,51.94 U$4.ISP_MOSI
N$1
  Top 0.254: Q2.3 30.48,45.09 33.27,45.09 | 33.27,45.09 34.29,45.09 Q1.3 | R2.P$1 33.27,48.64 33.27,45.09
N$2
  Bottom 0.254: Q4.3 20.32,45.09 23.11,45.09 | 23.11,45.09 24.13,45.09 Q3.3 | R6.P$1 23.11,49.28 23.11,45.09
N$3
  Bottom 0.254: X3.3 85.09,60.96 85.09,35.56 86.36,34.29 JP6.2
N$4
  Top 0.254: Q7.3 52.07,45.09 55.88,45.09 Q6.3
  Bottom 0.254: R10.P$1 50.04,50.67 50.04,47.12 Q7.3
N$5
  Top 0.254: Q8.3 45.72,45.09 41.91,45.09 Q9.3 39.5,45.72 39.5,49.66 R13.P$1
N$6
  Top 0.254: X1.3 7.62,53.34 7.62,66.67 X2.2 10.16,72.39 17.78,72.39 23.5,66.67 38.1,66.67 R4.P$1
N$7
  Bottom 0.381: X1.8 11.56,45.72 8.89,45.72 7.37,47.24 7.37,73.41 JP3.2
N$10
  Bottom 0.381: JP2.2 U$4.A2
N$16
  Top 0.254: U$13.1 X5.3
N$22
  Top 0.254: C8.1 70.48,46.35 71.12,45.72 R15.P$2 R16.P$2 X5.6
N$25
  Bottom 0.254: U$8.1 94.49,5.59 94.49,4.57 92.33,2.41 XRF.19
N$26
  Top 0.254: Q5.2 56.52,66.55 43.94,66.55 R8.P$2
  Bottom 0.254: R8.P$2 39.12,71.37 U$4.9
N$27
  Bottom 0.254: U$7.1 96.52,4.57 94.36,2.41 XRF.20
N$41
  Top 0.254: IC1.1 64.77,6.6 L1.P$2
N$42
  Top 0.254: R19.2 55.88,19.3 60.96,19.3 R18.1
N$46
  Top 0.254: R18.2 60.96,16.38 66.04,16.38 R17.1 66.04,16.26 66.17,16.26 66.17,12.19 64.14,10.16 58.29,10.16 IC1.4
RX1
  Bottom 0.254: U$4.2@1 81.28,77.72 97.54,77.72 98.42,76.83 98.42,21.59 97.16,20.32 94.61,20.32 92.08,22.86 92.08,24.13 XRF.2
SCK  (via drill 0.51)
  Top 0.254: v28.32,58.42 28.32,58.04 31.75,54.61 v60.33,54.61 61.59,53.34 U$4.ISP_SCK | X4.33 92.2,37.34 61.72,37.34 v60.96,38.1
  Bottom 0.254: v28.32,58.42 28.32,68.96 JP4.6 | v60.96,38.1 60.33,38.73 v60.33,54.61
SCL  (via drill 0.51)
  Top 0.254: U$4.21@1 86.36,73.66 85.09,72.39 82.55,72.39 81.28,73.66 v26.8,73.66
  Bottom 0.254: Q3.1 26.67,50.16 R5.P$1 26.67,53.98 25.15,55.24 25.15,72.01 v26.8,73.66
SDA  (via drill 0.51)
  Top 0.254: v80.01,72.39 59.05,72.39 59.05,65.41 v34.67,65.41
  Bottom 0.254: Q1.1 36.2,49.53 R1.P$1 36.2,55.88 34.67,57.4 v34.67,65.41 | v80.01,72.39 U$4.20@1
SHDN
  Top 0.254: Q5.3 R4.P$2
TX1
  Bottom 0.254: U$4.3@1 78.74,71.12 86.11,71.12 88.39,68.83 88.39,35.05 92.96,30.48 92.96,27.05 90.3,24.38 XRF.3
VIN  (via drill 0.51)
  Top 0.381: v17.78,54.61 X1.2 | X3.2 v81.53,57.4 | IC2.IN POWERPOD.VIN 27.3,30.48 29.84,33.02 45.72,33.02 | 56.9,5.08 56.9,6.6 IC1.6 | 56.9,5.08 56.9,2.54 C4.1 | IC1.3 64.77,8.64 L1.P$1 64.9,8.64 65.91,8.64 66.67,7.87 66.67,5.84 65.91,5.08 56.9,5.08 | 45.72,33.02 U$1.1 U$4.VIN | 45.72,33.02 C6.1 48.26,35.56 JP2.1 56.52,36.2 v69.85,36.2 | v69.85,39.37 82.55,39.37 X5.2
  Bottom 0.381: JP3.1 X2.1 17.78,65.41 v17.78,54.61 17.78,43.18 POWERPOD.ENABLE 21.34,36.58 21.34,32 POWERPOD.VIN | X5.2 81.66,42.8 81.66,57.28 v81.53,57.4 | L1.P$1 64.77,8.64 65.79,8.64 71.63,14.48 71.63,29.97 69.85,31.75 v69.85,36.2 v69.85,39.37
XRF_HEARTBEAT
  Bottom 0.254: U$9.1 72.39,2.54 84.45,14.61 84.45,24.13 XRF.6
XRF_ON  (via drill 0.51)
  Top 0.254: v97.16,22.23 80.39,5.46 80.39,2.41 XRF.13 | v83.82,73.66 83.06,74.42 72.9,74.42 U$4.23
  Bottom 0.254: v97.16,22.23 97.16,30.48 96.14,31.5 92.96,31.5 89.53,34.92 89.53,72.39 88.27,73.66 v83.82,73.66
XRF_P1_5
  Bottom 0.381: U$11.1 80.01,24.13 80.09,24.13 XRF.8
XRF_P1_6
  Bottom 0.381: U$10.1 82.55,24.13 82.5,24.13 XRF.7
XRF_SLEEP  (via drill 0.51)
  Top 0.254: v73.03,24.13 73.03,26.04 67.94,31.11 v60.71,31.11
  Bottom 0.254: v73.03,24.13 74.93,22.23 76.83,22.23 78.11,23.5 78.11,24.13 XRF.9 | v60.71,31.11 60.71,35.81 54.74,41.78 54.74,49.91 52.96,51.69 52.96,56.26 49.91,59.31 49.91,64.39 45.72,68.58 U$4.7

### Text on the board
tNames: ISP
tValues: VIN | +3V3 | IOREF | +5V
_tsilk: FLC100 shield v2.0 | FLC100 shield v2.0 | FLC100 shield v2.0
_bsilk: http://github.com/stevemarple/FLC100_shield | FLC100 shield v2.0